# Altium schematic sheet SPL06.SchDoc
size A4; SheetNumber: 3; SheetTotal: 3
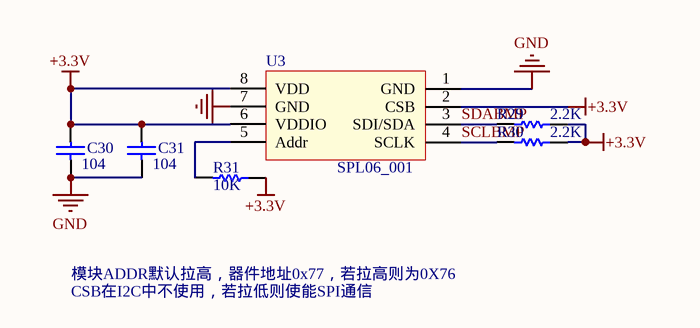
[diagram p0: SPL06.SchDoc]

## Parts
C30  104  [0603_C]
C31  104  [0603_C]
R29  2.2K  [0603R]
R30  2.2K  [0603R]
R31  10K  [0603R]
U3  SPL06_001  [FBM320]

## Nets
+3.3V: C30.2 C31.2 R29.1 R30.1 R31.1 U3.2(CSB) U3.6(VDDIO) U3.8(VDD)
GND: C30.1 C31.1 U3.1(GND) U3.7(GND)
SCLBMP: R30.2 U3.4(SCLK)
SDABMP: R29.2 U3.3(SDI/SDA)
NetR31_2: R31.2 U3.5(Addr)

## Notes on the sheet
- 模块ADDR默认拉高，器件地址0x77，若拉高则为0X76
- CSB在I2C中不使用，若拉低则使能SPI通信

## Library data of the parts
C30 C31 = Cap Chip 1206: Cap_0603; Published: 8-Jun-2000; Revision: July-2002: Re-released for DXP Platform.; Publisher: Altium Limited
R29-R31 = Res1: Resistor-0603; Published: 8-Jun-2000; LatestRevisionDate: 17-Jul-2002; LatestRevisionNote: Re-released for DXP Platform.; PackageReference: AXIAL-0.3; Publisher: Altium Limited; PackageDescription: Axial Device, Thru-Hole; 2 Leads; 0.3 in Pin Spacing
U3 = FBM320